# Altium schematic sheet TopSide.SchDoc
size Letter; DrawnBy: Adam Gilbert; Organization: Altium Limited; Address1: L3, 12a Rodborough Rd; Address2: Frenchs Forest; Address3: NSW; Address4: Australia 2086; DocumentNumber: 2; SheetNumber: 2; SheetTotal: 4
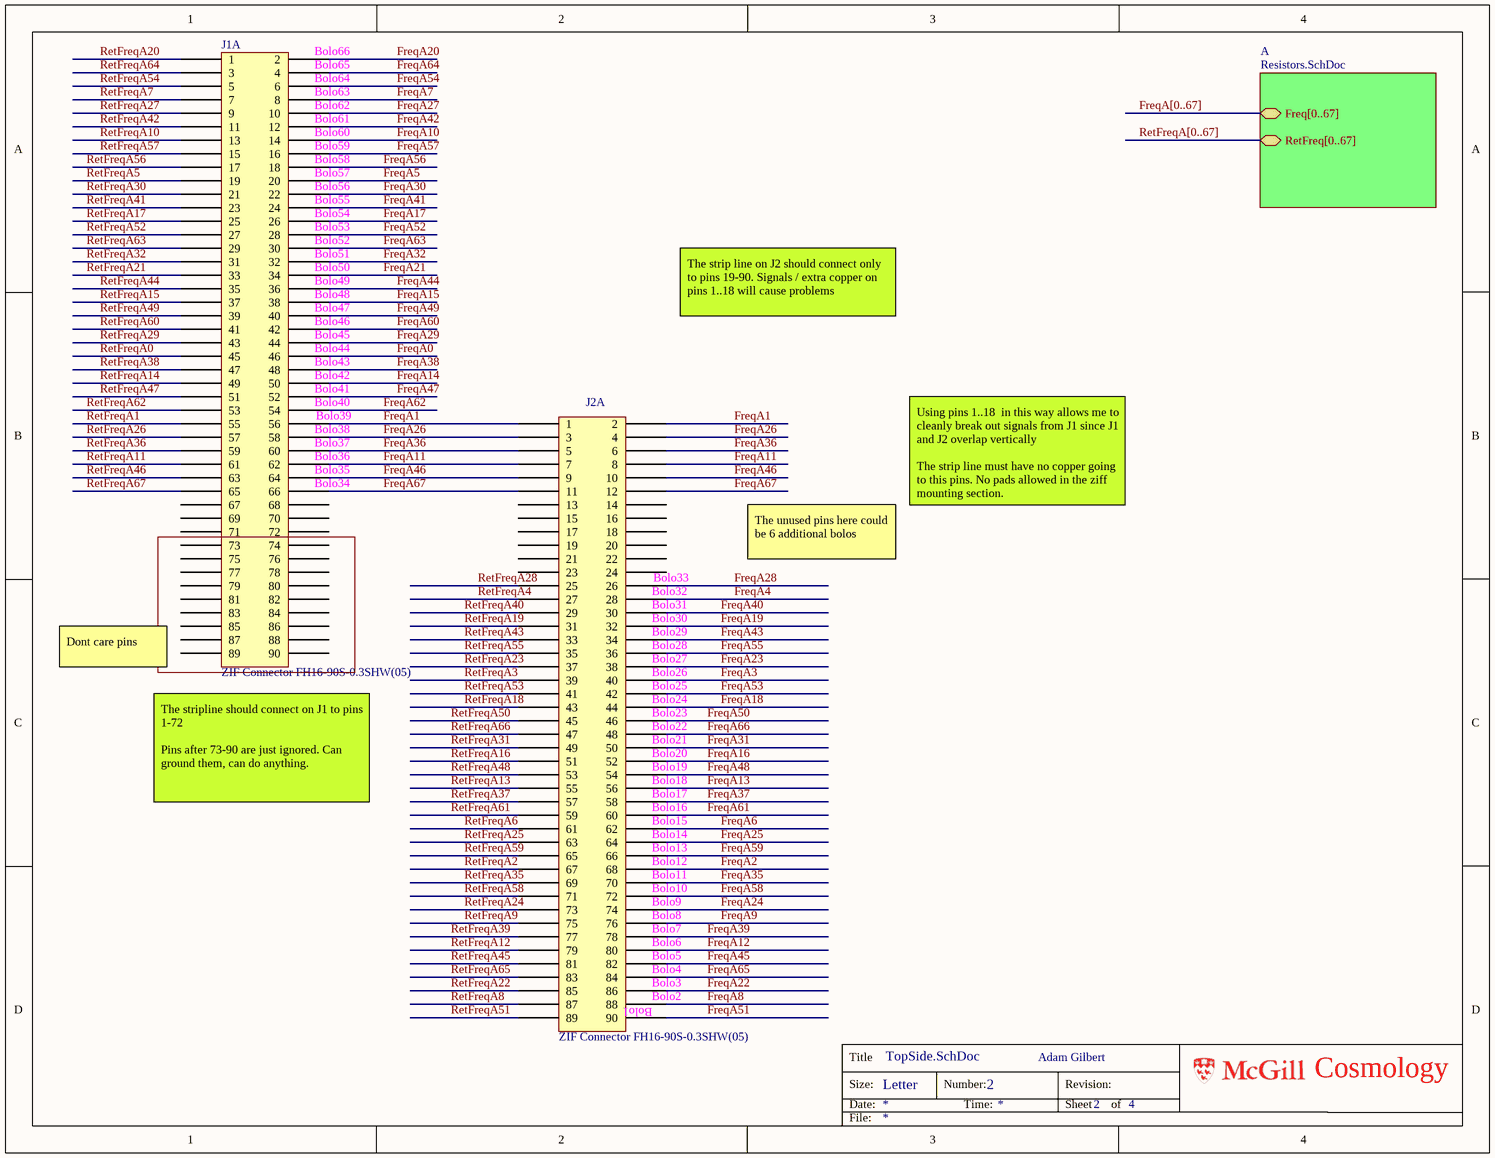
[diagram p0: TopSide.SchDoc]

## Parts
J1A  ZIF Connector FH16-90S-0.3SHW(05)  [LCBoard_ZIFCon]
J2A  ZIF Connector FH16-90S-0.3SHW(05)  [LCBoard_ZIFCon]

## Sub-sheets
A = Resistors.SchDoc: Freq[0..67], RetFreq[0..67]

## Nets
FreqA0: J1A.46
FreqA1: J1A.56 J2A.1 J2A.2
FreqA2: J2A.68
FreqA3: J2A.40
FreqA4: J2A.28
FreqA5: J1A.20
FreqA6: J2A.62
FreqA7: J1A.8
FreqA8: J2A.88
FreqA9: J2A.76
FreqA10: J1A.14
FreqA11: J1A.62 J2A.7 J2A.8
FreqA12: J2A.80
FreqA13: J2A.56
FreqA14: J1A.50
FreqA15: J1A.38
FreqA16: J2A.52
FreqA17: J1A.26
FreqA18: J2A.44
FreqA19: J2A.32
FreqA20: J1A.2
FreqA21: J1A.34
FreqA22: J2A.86
FreqA23: J2A.38
FreqA24: J2A.74
FreqA25: J2A.64
FreqA26: J1A.58 J2A.3 J2A.4
FreqA27: J1A.10
FreqA28: J2A.26
FreqA29: J1A.44
FreqA30: J1A.22
FreqA31: J2A.50
FreqA32: J1A.32
FreqA35: J2A.70
FreqA36: J1A.60 J2A.5 J2A.6
FreqA37: J2A.58
FreqA38: J1A.48
FreqA39: J2A.78
FreqA40: J2A.30
FreqA41: J1A.24
FreqA42: J1A.12
FreqA43: J2A.34
FreqA44: J1A.36
FreqA45: J2A.82
FreqA46: J1A.64 J2A.9 J2A.10
FreqA47: J1A.52
FreqA48: J2A.54
FreqA49: J1A.40
FreqA50: J2A.46
FreqA51: J2A.90
FreqA52: J1A.28
FreqA53: J2A.42
FreqA54: J1A.6
FreqA55: J2A.36
FreqA56: J1A.18
FreqA57: J1A.16
FreqA58: J2A.72
FreqA59: J2A.66
FreqA60: J1A.42
FreqA61: J2A.60
FreqA62: J1A.54
FreqA63: J1A.30
FreqA64: J1A.4
FreqA65: J2A.84
FreqA66: J2A.48
FreqA67: J1A.66 J2A.11 J2A.12
RetFreqA0: J1A.45
RetFreqA1: J1A.55
RetFreqA2: J2A.67
RetFreqA3: J2A.39
RetFreqA4: J2A.27
RetFreqA5: J1A.19
RetFreqA6: J2A.61
RetFreqA7: J1A.7
RetFreqA8: J2A.87
RetFreqA9: J2A.75
RetFreqA10: J1A.13
RetFreqA11: J1A.61
RetFreqA12: J2A.79
RetFreqA13: J2A.55
RetFreqA14: J1A.49
RetFreqA15: J1A.37
RetFreqA16: J2A.51
RetFreqA17: J1A.25
RetFreqA18: J2A.43
RetFreqA19: J2A.31
RetFreqA20: J1A.1
RetFreqA21: J1A.33
RetFreqA22: J2A.85
RetFreqA23: J2A.37
RetFreqA24: J2A.73
RetFreqA25: J2A.63
RetFreqA26: J1A.57
RetFreqA27: J1A.9
RetFreqA28: J2A.25
RetFreqA29: J1A.43
RetFreqA30: J1A.21
RetFreqA31: J2A.49
RetFreqA32: J1A.31
RetFreqA35: J2A.69
RetFreqA36: J1A.59
RetFreqA37: J2A.57
RetFreqA38: J1A.47
RetFreqA39: J2A.77
RetFreqA40: J2A.29
RetFreqA41: J1A.23
RetFreqA42: J1A.11
RetFreqA43: J2A.33
RetFreqA44: J1A.35
RetFreqA45: J2A.81
RetFreqA46: J1A.63
RetFreqA47: J1A.51
RetFreqA48: J2A.53
RetFreqA49: J1A.39
RetFreqA50: J2A.45
RetFreqA51: J2A.89
RetFreqA52: J1A.27
RetFreqA53: J2A.41
RetFreqA54: J1A.5
RetFreqA55: J2A.35
RetFreqA56: J1A.17
RetFreqA57: J1A.15
RetFreqA58: J2A.71
RetFreqA59: J2A.65
RetFreqA60: J1A.41
RetFreqA61: J2A.59
RetFreqA62: J1A.53
RetFreqA63: J1A.29
RetFreqA64: J1A.3
RetFreqA65: J2A.83
RetFreqA66: J2A.47
RetFreqA67: J1A.65

Not connected (* = marked no-connect by the designer): J1A 67 68 69 70 71 72 73 74 75 76 77 78 79 80 81 82 83 84 85 86 87 88 89 90; J2A 13 14 15 16 17 18 19 20 21 22 23 24

## Buses and harness runs
bus FreqA[0..67] = sheet A/Freq[0..67]
bus RetFreqA[0..67] = sheet A/RetFreq[0..67]

## Notes on the sheet
- (near J1A) Bolo63
- (near J1A) Bolo64
- (near J1A) Bolo65
- (near J1A) Bolo66
- (near J1A) Bolo58
- (near J1A) Bolo59
- (near J1A) Bolo60
- (near J1A) Bolo61
- (near J1A) Bolo62
- (near J1A) Bolo53
- (near J1A) Bolo54
- (near J1A) Bolo55
- (near J1A) Bolo56
- (near J1A) Bolo57
- (near J1A) Bolo48
- (near J1A) Bolo49
- (near J1A) Bolo50
- (near J1A) Bolo51
- (near J1A) Bolo52
- (near J1A) Bolo43
- (near J1A) Bolo44
- (near J1A) Bolo45
- (near J1A) Bolo46
- (near J1A) Bolo47
- The strip line on J2 should connect only to pins 19-90. Signals / extra copper on pins 1..18 will cause problems
- (near J1A) Bolo40
- (near J1A) Bolo41
- (near J1A) Bolo42
- (near J1A) Bolo38
- (near J1A) Bolo39
- (near J1A) Bolo34
- (near J1A) Bolo35
- (near J1A) Bolo36
- (near J1A) Bolo37
- Using pins 1..18  in this way allows me to cleanly break out signals from J1 since J1 and J2 overlap vertically
  The strip line must have no copper going to this pins. No pads allowed in the ziff mounting section.
- The unused pins here could be 6 additional bolos
- (near J2A) Bolo29
- (near J2A) Bolo30
- (near J2A) Bolo31
- (near J2A) Bolo32
- (near J2A) Bolo33
- Dont care pins
- (near J2A) Bolo24
- (near J2A) Bolo25
- (near J2A) Bolo26
- (near J2A) Bolo27
- (near J2A) Bolo28
- (near J2A) Bolo19
- (near J2A) Bolo20
- (near J2A) Bolo21
- (near J2A) Bolo22
- (near J2A) Bolo23
- (near J1A) The stripline should connect on J1 to pins 1-72
  Pins after 73-90 are just ignored. Can ground them, can do anything.
- (near J2A) Bolo14
- (near J2A) Bolo15
- (near J2A) Bolo16
- (near J2A) Bolo17
- (near J2A) Bolo18
- (near J2A) Bolo9
- (near J2A) Bolo10
- (near J2A) Bolo11
- (near J2A) Bolo12
- (near J2A) Bolo13
- (near J2A) Bolo4
- (near J2A) Bolo5
- (near J2A) Bolo6
- (near J2A) Bolo7
- (near J2A) Bolo8
- (near J2A) Bolo2
- (near J2A) Bolo3
- (near J2A) Bolo1
- Title
- Size:
- Date:
- Letter
- Number:
- Time:
- Revision:
- Sheet
- of
- Cosmology
- File:

## Library data of the parts
J1A J2A = LCboard_FH16-90S-0.3SHW(05)